# Altium schematic sheet Output.SchDoc: Buck Sinc Converter
size A4; Organization: UDESC; Revision: R0; SheetNumber: 9; SheetTotal: 10
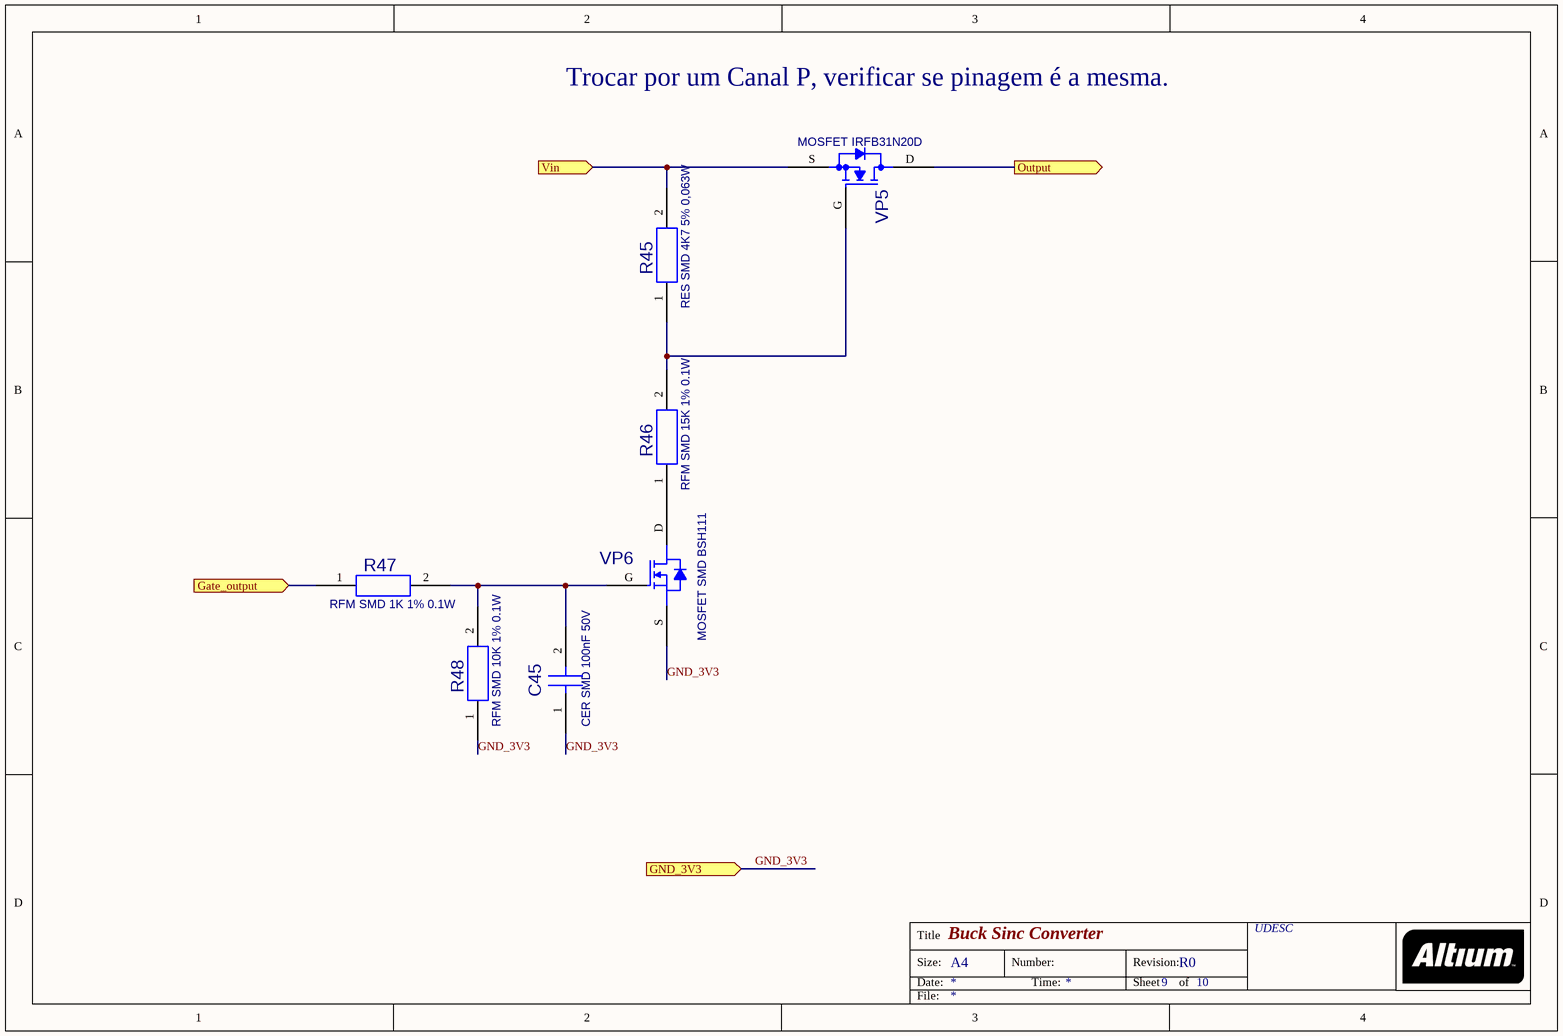
[diagram p0: Output.SchDoc]

## Parts
C45  value CER SMD 100nF 50V  [C0805_R_V0]  (hidden comment: 10192075)
R45  value RES SMD 4K7 5% 0,063W  [R0805_R_V0]  (hidden comment: 11417855)
R46  value RFM SMD 15K 1% 0.1W  [R0805_R_V0]  (hidden comment: 10118078)
R47  value RFM SMD 1K 1% 0.1W  [R0805_R_V0]  (hidden comment: 10118077)
R48  value RFM SMD 10K 1% 0.1W  [R0805_R_V0]  (hidden comment: 10118076)
VP5  value MOSFET IRFB31N20D  [TO-220AB (Primary)]  (hidden comment: 10190449)
VP6  value MOSFET SMD BSH111  [MOS_SOT23A]  (hidden comment: 11110327)

## Ports
Gate_output (in), GND_3V3 (in), Output (out), Vin (in)

## Nets
Gate_output: R47.1 ; port Gate_output
GND_3V3: C45.1 R48.1 VP6.S ; port GND_3V3
Output: VP5.D ; port Output
Vin: R45.2 VP5.S ; port Vin
NetC45_2: C45.2 R47.2 R48.2 VP6.G
NetR45_1: R45.1 R46.2 VP5.G
NetR46_1: R46.1 VP6.D

## Notes on the sheet
- Trocar por um Canal P, verificar se pinagem é a mesma.
- Title
- Size:
- Date:
- A4
- Number:
- Time:
- Revision:
- Sheet
- of
- File:

## Library data of the parts
C45 = 10192075: CER SMD 100nF 50V; HISsym: Atualizado em 12/07/05; TOL: 10%; ITEM BAAN: 0333.0044; PN: 10192075; PMT: SMD
R45 = 10118077: RES SMD 4K7 5% 0,063W; HISsym: Atualizado em 20/07/05; PN: 11417855; PMT: SMD
R46 = 10118077: RFM SMD 15K 1% 0.1W; HISsym: Atualizado em 20/07/05; PN: 10118078; PMT: SMD
R47 = 10118077: RFM SMD 1K 1% 0.1W; HISsym: Atualizado em 20/07/05; PN: 10118077; PMT: SMD
R48 = 10118077: RFM SMD 10K 1% 0.1W; HISsym: Atualizado em 20/07/05; PN: 10118076; PMT: SMD
VP5 = 10190449: MOSFET IRFB31N20D; HISsym: Atualizado em 20/04/06; HISitem: Criado em 20/04/06; PMT: THT; PN: 10190449
VP6 = 11110327: MOSFET SMD BSH111; HISsym: Atualizado em 12/09/05; HISitem: Criado em 20/12/07 (p/ Ricardo); PN: 11110327; PMT: SMD